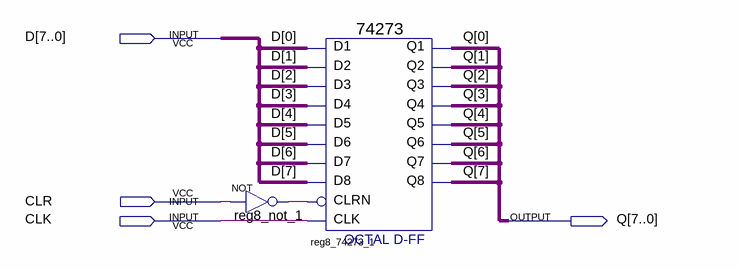
[diagram p0: schematic sheet]
// Quartus schematic reg8.bdf as structural Verilog: 2 symbols, 4 pins
module reg8 (
  input  [7:0] D,
  input  CLR,
  input  CLK,
  output [7:0] Q
);

  wire reg8_not_1_out;

  not reg8_not_1 (reg8_not_1_out, CLR);
  \74273  reg8_74273_1 (
    .D2(D[1]), .D3(D[2]), .D1(D[0]), .D4(D[3]), .D7(D[6]), .D6(D[5]), .D5(D[4]), .D8(D[7]), .CLK(CLK),
    .CLRN(reg8_not_1_out), .Q4(Q[3]), .Q1(Q[0]), .Q2(Q[1]), .Q3(Q[2]), .Q6(Q[5]), .Q5(Q[4]), .Q7(Q[6]),
    .Q8(Q[7]));
endmodule
